# Altium schematic sheet Buttons.SchDoc
size A4; SheetNumber: 6; SheetTotal: 9
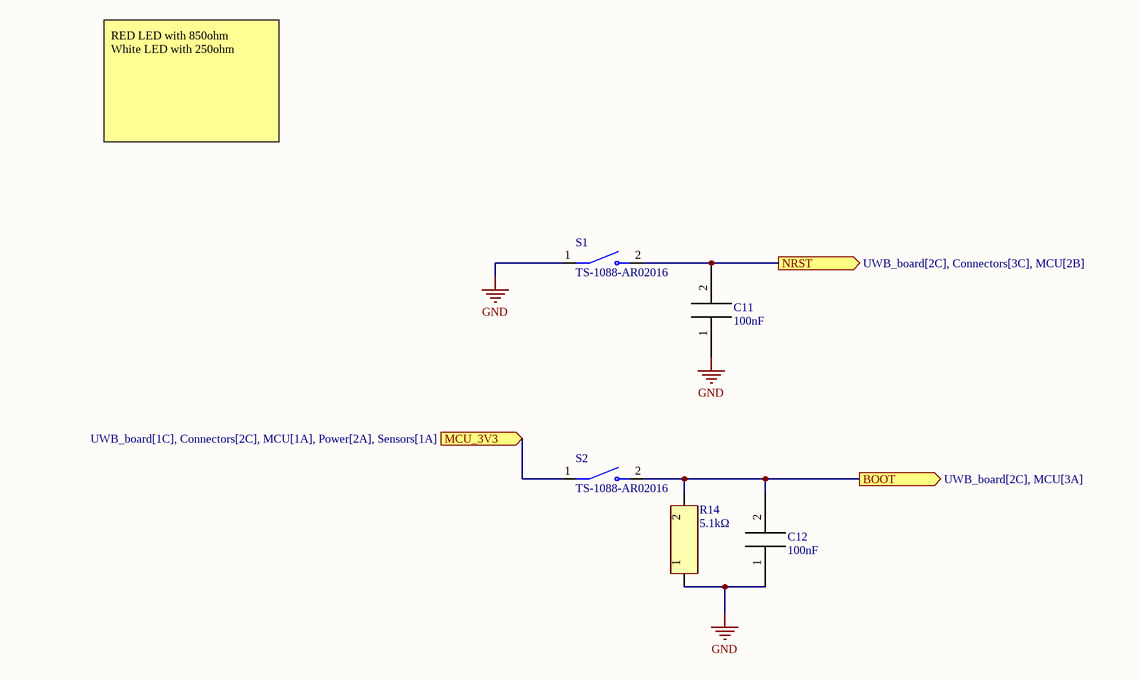
[diagram p0: Buttons.SchDoc]

## Parts
C11  100nF  [0603_cap]
C12  100nF  [0603_cap]
R14  value 5.1kΩ  [0603_res]  (hidden comment: 5.1k)
S1  TS-1088-AR02016  [SW_TS-1088-AR02016]
S2  TS-1088-AR02016  [SW_TS-1088-AR02016]

## Ports
BOOT (out, see UWB_board[2C], MCU[3A]), MCU_3V3 (in, see UWB_board[1C], Connectors[2C], MCU[1A], Power[2A], Sensors[1A]), NRST (out, see UWB_board[2C], Connectors[3C], MCU[2B])

## Nets
GND: C11.1 C12.1 R14.1 S1.1
BOOT: C12.2 R14.2 S2.2 ; port BOOT
MCU_3V3: S2.1 ; port MCU_3V3
NRST: C11.2 S1.2 ; port NRST

## Notes on the sheet
- RED LED with 850ohm
  White LED with 250ohm

## Library data of the parts
C11 C12 = CC0603KRX7R9BB104: 100nF 50V X7R ±10% 0603 Multilayer Ceramic Capacitors MLCC - SMD/SMT ROHS; LCSC Part #: C14663; Value: 100nF
R14 = 0603WAF5101T5E: 5.1kΩ -55℃~+155℃ 100mW 75V Thick Film Resistor ±1% ±100ppm/℃ 0603 Chip Resistor - Surface Mount ROHS; LCSC Part #: C23186
S1 S2 = TS-1088-AR02016: 50mA 4mm 100MÎ© 100,000 Times 12V 160gf 3mm 2mm Round Button Vertical welding SPST SMD Tactile Switches ROHS; LCSC Part #: C720477